# EAGLE design xio (EAGLE 5.02)
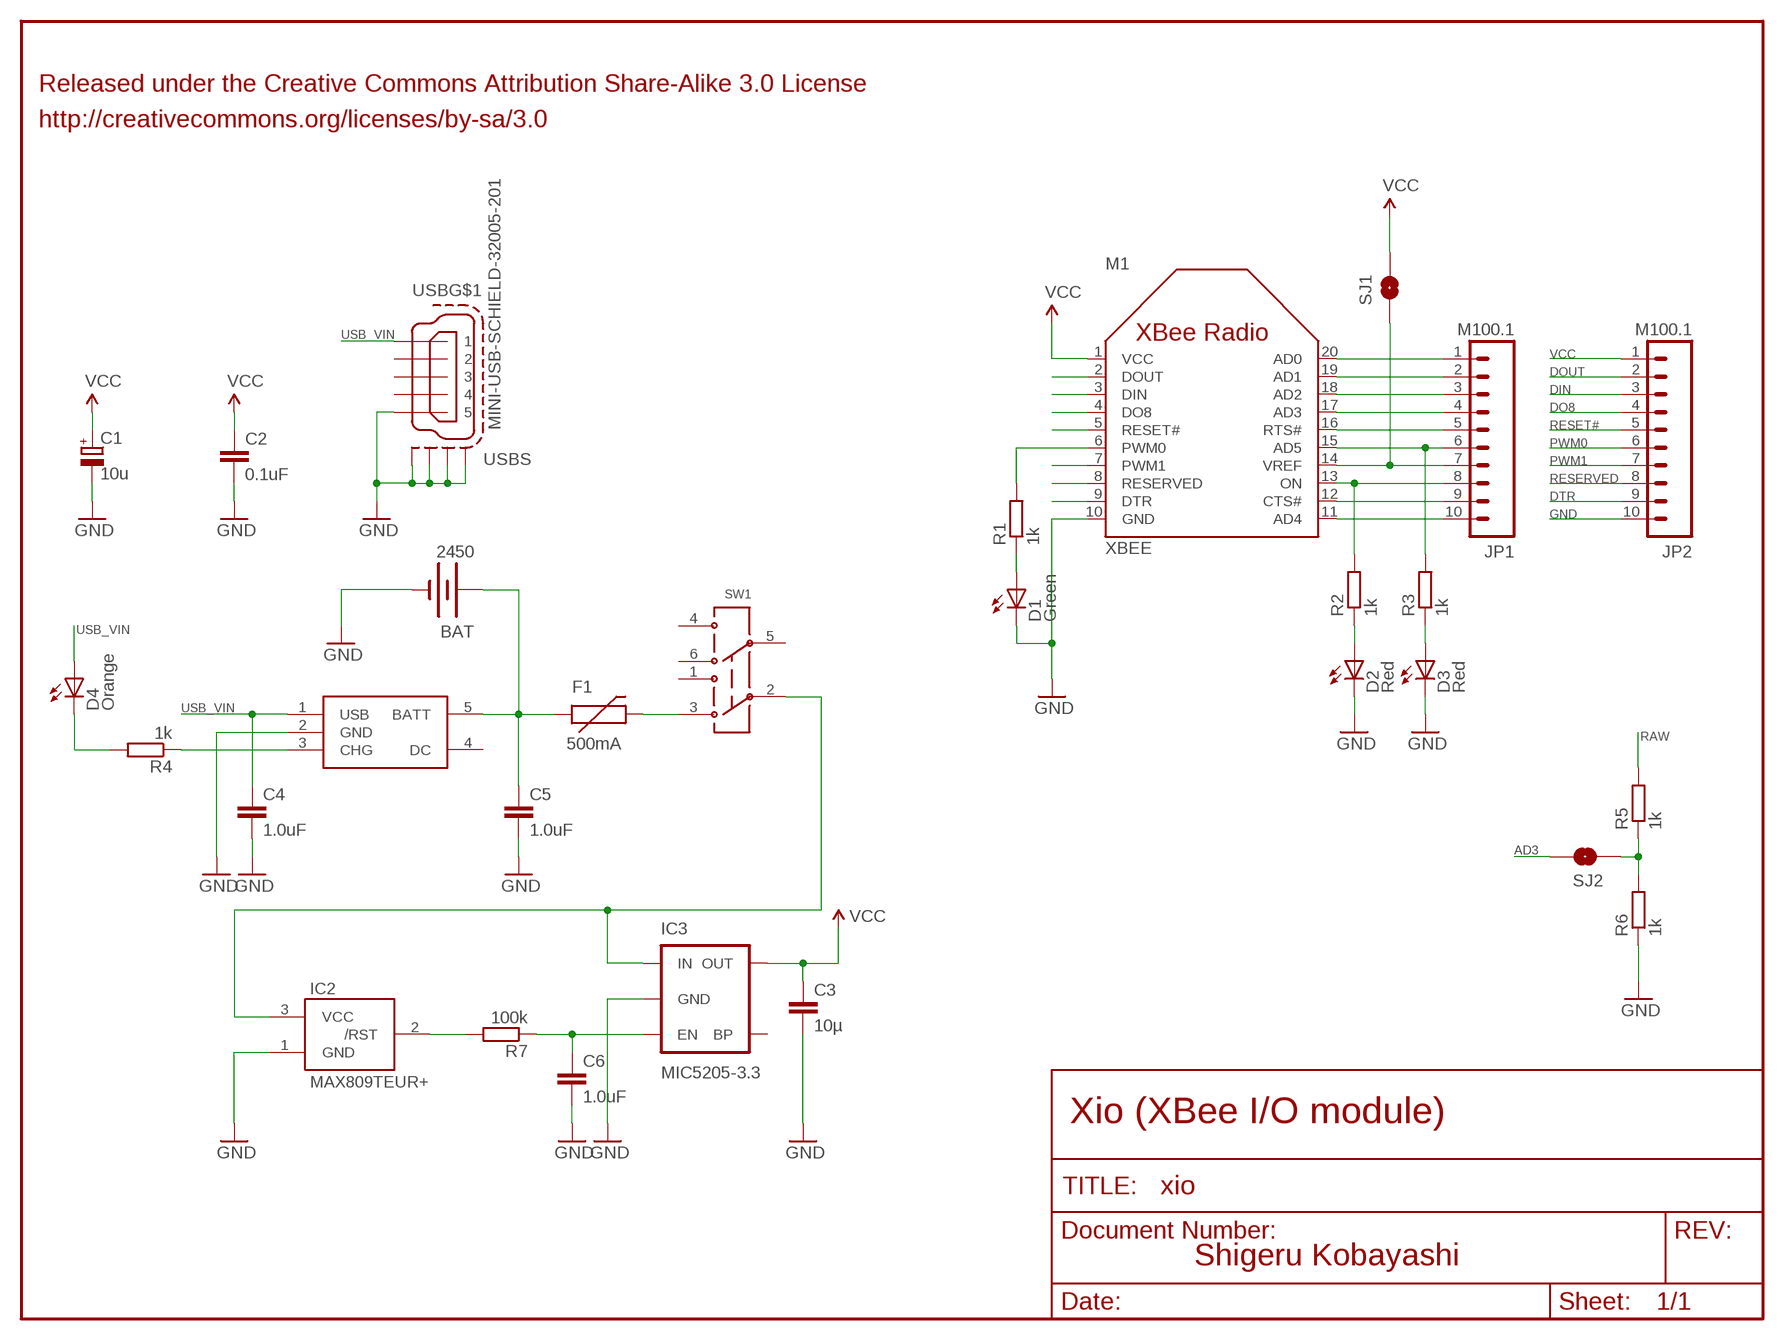
[diagram p0: schematic, sheet 1]

## Parts
BAT  2450  BATTERY  [3009]
C1  10u  CPOL-EUC  [PANASONIC_C]
C2  0.1uF  CAP0603  [0603]
C3  10µ  C-EUC0805K  [C0805K]
C4  1.0uF  CAP0603  [0603]
C5  1.0uF  CAP0603  [0603]
C6  1.0uF  CAP0603  [0603]
D1  Green  LEDCHIPLED_0805  [CHIPLED_0805]
D2  Red  LEDCHIPLED_0805  [CHIPLED_0805]
D3  Red  LEDCHIPLED_0805  [CHIPLED_0805]
D4  Orange  LEDCHIPLED_0805  [CHIPLED_0805]
F1  500mA  PTCSMD  [PTC-1206]
IC1  MAX1555  [SOT23-5]
IC2  MAX809TEUR+  MAX809TEUR  [SOT23]
IC3  MIC5205-3.3  V_REG_LDOSMD  [SOT23-5]
JP1  M100.1  [1X10]
JP2  M100.1  [1X10]
M1  XBEE  [XBEE]
R1  1k  R-EU_R0603  [R0603]
R2  1k  R-EU_R0603  [R0603]
R3  1k  R-EU_R0603  [R0603]
R4  1k  R-EU_R0603  [R0603]
R5  1k  R-EU_R0603  [R0603]
R6  1k  R-EU_R0603  [R0603]
R7  100k  R-EU_R0603  [R0603]
SJ1  SOLDERJUMPERNO  [SJ-NO]
SJ2  SOLDERJUMPERNO  [SJ-NO]
SW1  AYZ0202  [AYZ0202]
USB  MINI-USB-SCHIELD-32005-201  [32005-201]

## Nets
AD3: JP1.4 M1.17(AD3) SJ2.2
AD4: JP1.10 M1.11(AD4)
DIN: JP2.3 M1.3(DIN)
DO8: JP2.4 M1.4(DO8)
DOUT: JP2.2 M1.2(DOUT)
DTR: JP2.9 M1.9(DTR)
GND: BAT.- C1.- C2.2 C3.2 C4.2 C5.2 C6.2 D1.C D2.C D3.C IC1.2(GND) IC2.1(GND) IC3.2(GND) JP2.10 M1.10(GND) R6.1 USB.5 USB.M1(S:S1) USB.M2(S:S2) USB.M3(S:S3) USB.M4(S:S4)
N$1: JP1.8 M1.13(ON) R2.2
N$2: JP1.1 M1.20(AD0)
N$3: D1.A R1.1
N$4: IC2.2(/RST) R7.2
N$6: D2.A R2.1
N$7: JP1.2 M1.19(AD1)
N$8: D4.C R4.2
N$9: F1.2 SW1.3
N$10: JP1.3 M1.18(AD2)
N$11: IC1.3(CHG) R4.1
N$12: C6.1 IC3.3(EN) R7.1
N$13: JP1.5 M1.16(RTS#)
N$14: JP1.6 M1.15(AD5) R3.2
N$15: JP1.7 M1.14(VREF) SJ1.1
N$16: JP1.9 M1.12(CTS#)
N$18: D3.A R3.1
N$19: R5.1 R6.2 SJ2.1
PWM0: JP2.6 M1.6(PWM0) R1.2
PWM1: JP2.7 M1.7(PWM1)
RAW: IC2.3(VCC) IC3.1(IN) R5.2 SW1.2
RESERVED: JP2.8 M1.8(RESERVED)
RESET#: JP2.5 M1.5(RESET#)
USB_VIN: C4.1 D4.A IC1.1(USB) USB.1
VBATT: BAT.+@1(+) C5.1 F1.1 IC1.5(BATT)
VCC [VCC]: C1.+ C2.1 C3.1 IC3.5(OUT) JP2.1 M1.1(VCC) SJ1.2
Unconnected: IC1.4(DC) IC3.4(BP) SW1.1 SW1.4 SW1.5 SW1.6 USB.2 USB.3 USB.4

## Notes on the sheet
- Released under the Creative Commons Attribution Share-Alike 3.0 License
- http://creativecommons.org/licenses/by-sa/3.0
- Xio (XBee I/O module)
- Shigeru Kobayashi

## Library data of the parts
BAT = keystone:BATTERY: Battery Holders 2032 coin cell and 2450 coin cell.
C1 = rcl:CPOL-EU: POLARIZED CAPACITOR, European symbol
C2 C4-C6 = SparkFun:CAP: Capacitor Standard 0603 ceramic capacitor, and 0.1" leaded capacitor.
C3 = rcl:C-EU: CAPACITOR, European symbol
D1-D4 = led:LED: LED OSRAM: - CHIPLED LG R971, LG N971, LY N971, LG Q971, LY Q971, LO R971, LY R971 LH N974, LH R974 LS Q976, LO Q976, LY Q976 LO Q996 - Hyper CHIPLED LW Q18S LB Q993, LB Q99A, LB R99A - SideLED LS A670, LO A670, LY A670, LG A670, LP A670 LB A673, LV A673, LT A673, LW A673 LH A674 LY A675 LS A676, LA A676, LO A676, LY A676, LW A676 LS A679, LY A679, LG A679 - Hyper Micro SIDELED® LS Y876, LA Y876, LO Y876, LY Y876 LT Y87S - SmartLED LW L88C, LW L88S LB L89C, LB L89S, LG L890 LS L89K, LO L89K, LY L89K LS L896, LA L896, LO L896, LY L896 - TOPLED LS T670, LO T670, LY T670, LG T670, LP T670 LSG T670, LSP T670, LSY T670, LOP T670, LYG T670 LG T671, LOG T671, LSG T671 LB T673, LV T673, LT T673, LW T673 LH T674 LS T676, LA T676, LO T676, LY T676, LB T676, LH T676, LSB T676, LW T676 LB T67C, LV T67C, LT T67C, LS T67K, LO T67K, LY T67K, LW E67C LS E67B, LA E67B, LO E67B, LY E67B, LB E67C, LV E67C, LT E67C LW T67C LS T679, LY T679, LG T679 LS T770, LO T770, LY T770, LG T770, LP T770 LB T773, LV T773, LT T773, LW T773 LH T774 LS E675, LA E675, LY E675, LS T675 LS T776, LA T776, LO T776, LY T776, LB T776 LHGB T686 LT T68C, LB T68C - Hyper Mini TOPLED® LB M676 - Mini TOPLED Santana® LG M470 LS M47K, LO M47K, LY M47K Source: http://www.osram.convergy.de - LUMILED® LXK2-PW12-R00, LXK2-PW12-S00, LXK2-PW14-U00, LXK2-PW14-V00 LXK2-PM12-R00, LXK2-PM12-S00, LXK2-PM14-U00 LXK2-PE12-Q00, LXK2-PE12-R00, LXK2-PE12-S00, LXK2-PE14-T00, LXK2-PE14-U00 LXK2-PB12-K00, LXK2-PB12-L00, LXK2-PB12-M00, LXK2-PB14-N00, LXK2-PB14-P00, LXK2-PB14-Q00 LXK2-PR12-L00, LXK2-PR12-M00, LXK2-PR14-Q00, LXK2-PR14-R00 LXK2-PD12-Q00, LXK2-PD12-R00, LXK2-PD12-S00 LXK2-PH12-R00, LXK2-PH12-S00 LXK2-PL12-P00, LXK2-PL12-Q00, LXK2-PL12-R00 Source: www.luxeon.com
F1 = SparkFun:PTC: Resettable Fuse PTC Resettable Fuse. Spark Fun Electronics SKU : COM-08357
IC1 = SparkFun:MAX1555: MAX1555 Lithium Charger IC SOT-23 Lithium Polymer charging IC. Schematic element and footprint proven. Spark Fun Electronics SKU : COM-00674
IC2 = maxim-10:MAX809*: 3-Pin Microprocessor Reset Circuit
IC3 = SparkFun:V_REG_LDO: Voltage Regulator LDO Standard 150mA LDO voltage regulator in SOT-23 layout. Micrel part MIC5205. BP (by-pass) pin is used to lower output noise with 470pF cap.
JP1 JP2 = SparkFun:M10: Header 10 Standard 10-pin 0.1" header. Use with straight break away headers (SKU : PRT-00116), right angle break away headers (PRT-00553), swiss pins (PRT-00743), machine pins (PRT-00117), and female headers (PRT-00115).
M1 = digi_xbee:XBEE
R1-R7 = rcl:R-EU_: RESISTOR, European symbol
SJ1 SJ2 = SparkFun:SOLDERJUMPER: Solder Jumper Standard SMD solder jumper. Used to automate production. Two varients : Normally Open and Normally Closed are the same, but have different paste layers. NC will have a large amount of paste and should jumper during reflow.
SW1 = SparkFun:AYZ0202: SPDT Slide Switch Simple SMD single-pull double-throw slide switch. Good for less than 350mA power switch, switching UARTs between devices, etc. Spark Fun Electronics SKU : COM-00597
USB = con-cypressindustries:MINI-USB-SCHIELD-: MINI USB-B Conector Source: www.cypressindustries.com

## Net classes
0 Default: width 0.203 mm
1 VCC: width 0.381 mm
2 LEDPower: width 0.203 mm
3 ButtonSignal: width 0.203 mm

## Board
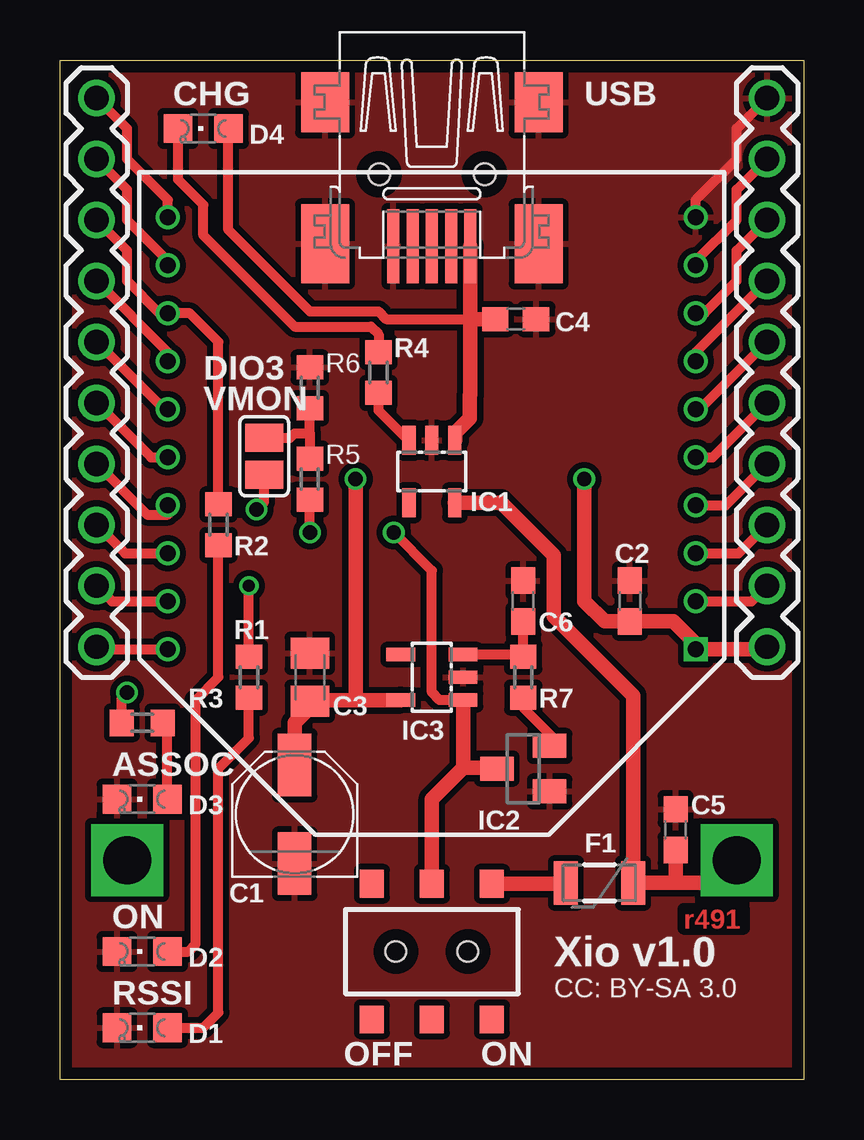
[diagram p1: board, top side]
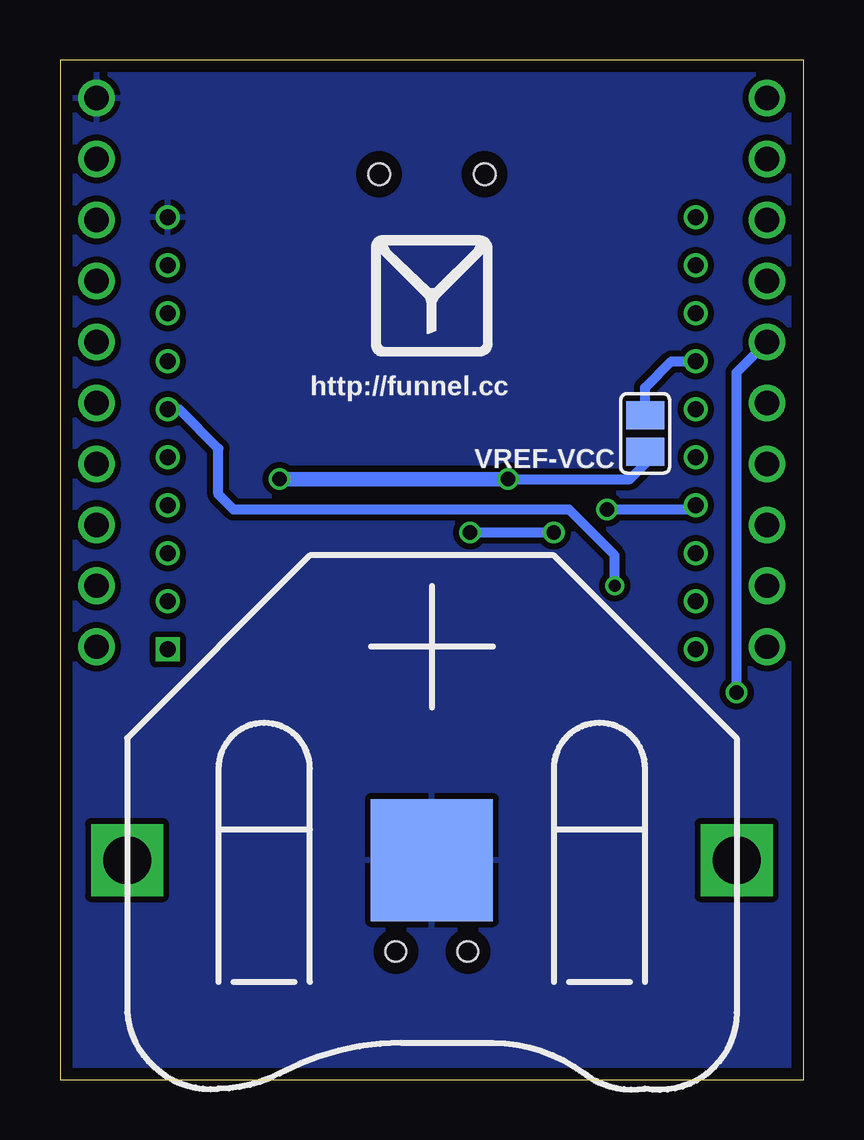
[diagram p2: board, bottom side, seen from below]

Size 30.99 x 42.48 mm. Coordinates in mm from the lower left corner, seen from the top.
Outline: 30.99,42.48 30.99,0 0,0 0,42.48 30.99,42.48
Copper layers (1*16): Top 0.035mm / dielectric 1.5mm / Bottom 0.035mm
Design rules "p_ban_2layer *": minimum track width 5mil, minimum drill 0.3mm, track to track 5mil, track to pad 5mil, pad to pad 5mil, via to via 5mil, smd to smd 5mil, copper to edge 0.5mm, drill to drill 0.3mm, minimum pad ring 0.15mm, minimum via ring 0.15mm, stop-mask expansion 4mil, vias tented up to drill 0.35mm, thermal gap 10mil

### Footprints (pad centres in the part's own frame; a part is rotated, then mirrored left to right if it is on the bottom)
3009 = drill 2 square: +@1 12.7,0; +@2 -12.7,0 | smd 5.08 x 5.08: - 0,0
PANASONIC_C = smd 2.6 x 1.4: + 2.05,0; - -2.05,0
0603 = smd 1.1 x 1: 1 -0.85,0; 2 0.85,0
C0805K = smd 1.3 x 1.6: 1 -1,0; 2 1,0
CHIPLED_0805 = smd 1.2 x 1.2: A 0,-1.05; C 0,1.05
PTC-1206 = smd 1 x 1.8: 1 -1.4,0; 2 1.4,0
SOT23-5 = smd 0.55 x 1.2: 1 -0.95,-1.3; 2 0,-1.3; 3 0.95,-1.3; 4 0.95,1.3; 5 -0.95,1.3
SOT23 = smd 1 x 1.4: 1 -0.95,-1.1; 2 0.95,-1.1; 3 0,1.1
1X10 = drill 1.016 round: 1 0,0; 2 2.54,0; 3 5.08,0; 4 7.62,0; 5 10.16,0; 6 12.7,0; 7 15.24,0; 8 17.78,0; 9 20.32,0; 10 22.86,0
XBEE = drill 0.66 square: 1 -11,9 | drill 0.66 round: 2 -11,7; 3 -11,5; 4 -11,3; 5 -11,1; 6 -11,-1; 7 -11,-3; 8 -11,-5; 9 -11,-7; 10 -11,-9; 11 11,-9; 12 11,-7; 13 11,-5; 14 11,-3; 15 11,-1; 16 11,1; 17 11,3; 18 11,5; 19 11,7; 20 11,9
R0603 = smd 1 x 1.1: 1 -0.85,0; 2 0.85,0
SJ-NO = smd 1.168 x 1.6: 1 -0.762,0; 2 0.762,0
AYZ0202 = smd 1 x 1.15: 1 -2.5,2.825; 2 0,2.825; 3 2.5,2.825; 4 -2.5,-2.825; 5 0,-2.825; 6 2.5,-2.825 | hole 0.85: 1.5,0; -1.5,0
32005-201 = smd 3.1 x 0.5: 1 3,1.6; 2 3,0.8; 3 3,0; 4 3,-0.8; 5 3,-1.6 | smd 2.5 x 2: M1 -3,-4.45; M2 -3,4.45 | smd 3.3 x 2: M3 2.9,4.45; M4 2.9,-4.45 | hole 0.9: 0,2.2; 0,-2.2

### Placement (x,y rotation side)
BAT  15.49,9.14 180 bottom
C1  9.78,11.05 90 top
C2  23.75,19.94 90 top
C3  10.41,16.76 90 top
C4  18.99,31.69 0 top
C5  25.65,10.41 90 top
C6  19.3,19.94 90 top
D1  3.43,2.16 90 top
D2  3.43,5.33 90 top
D3  3.43,11.68 90 top
D4  5.97,39.62 90 top
F1  22.48,8.19 180 top
IC1  15.49,25.34 180 top
IC2  19.3,12.95 90 top
IC3  15.49,16.76 90 top
JP1  1.52,18.03 90 top
JP2  29.46,18.03 90 top
M1  15.49,26.92 180 top
R1  7.87,16.76 90 top
R2  6.6,23.11 90 top
R3  3.43,14.86 180 top
R4  13.27,29.46 90 top
R5  10.41,25.02 270 top
R6  10.41,28.83 270 top
R7  19.3,16.76 270 top
SJ1  6.6,26.92 270 bottom
SJ2  8.51,25.97 270 top
SW1  15.49,5.33 0 top
U$1  [FUNNEL_LOGO_TOP_SMALL]  15.49,32.64 0 bottom
USB  15.49,37.72 270 top

### Tracks (layer width: path | path; a pad name or v marks a point on that pad's centre or on a via)
AD3  (via drill 0.6)
  Top 0.406: M1.17 4.49,23.54 3.63,23.54 JP1.4 | SJ2.2 8.51,24.07 v8.19,23.75
  Bottom 0.406: 4.49,23.95 4.38,24.07 | M1.17 4.49,23.95 | v8.19,23.75 4.7,23.75 4.49,23.95
AD4
  Top 0.406: M1.11 4.49,36.65 2.79,38.35 2.79,39.62 JP1.10
DIN
  Top 0.406: M1.3 28.27,21.92 JP2.3
DO8
  Top 0.406: M1.4 27.73,23.92 JP2.4
DOUT
  Top 0.406: M1.2 28.81,19.92 JP2.2
DTR
  Top 0.406: M1.9 26.49,34.11 28.19,35.81 28.19,37.08 JP2.9
GND
  Top 0.406: M1.10 26.49,36.65 28.19,38.35 28.19,39.62 JP2.10
  pour Top (isolate 0.254, rank 2): -1.02,43.43 32,43.43 32,-1.02 -1.02,-1.02
  pour Bottom (isolate 0.254): 0.25,44.7 30.73,44.7 30.73,-1.02 0.25,-1.02
N$1
  Top 0.406: R2.2 6.6,30.73 5.41,31.92 M1.13 4.14,31.92 2.79,33.27 2.79,34.54 JP1.8
N$2
  Top 0.406: M1.20 1.63,17.92 JP1.1
N$3
  Top 0.406: R1.1 7.87,14.22 6.6,12.95 6.6,2.79 5.97,2.16 D1.A
N$4
  Top 0.406: IC2.2 20.4,14.05 20.57,14.22 19.3,15.49 R7.2
N$6
  Top 0.406: D2.A 5.33,5.33 5.65,5.65 5.65,15.81 6.6,16.76 R2.1
N$7
  Top 0.406: M1.19 2.17,19.92 JP1.2
N$8
  Top 0.406: D4.C 4.92,37.5 5.97,36.45 5.97,35.18 9.78,31.37 12.95,31.37 13.27,31.05 R4.2
N$9
  Top 0.406: F1.2 21.21,8.19 21.18,8.16
  Top 0.61: SW1.3 21.18,8.16
N$10
  Top 0.406: M1.18 2.71,21.92 JP1.3
N$11
  Top 0.406: R4.1 13.27,27.88 14.51,26.64 IC1.3
N$12
  Top 0.406: IC3.3 19.3,17.71 19.3,17.72 R7.1 C6.1 19.3,19.3
N$13
  Top 0.406: M1.16 3.79,25.92 JP1.5
N$14  (via drill 0.6)
  Top 0.406: R3.2 2.58,15.91 v2.79,16.13 | M1.15 4.33,27.92 JP1.6
  Bottom 0.406: v2.79,16.13 2.79,29.46 JP1.6
N$15
  Top 0.406: M1.14 4.49,30.3 JP1.7
  Bottom 0.406: M1.14 5.51,29.92 6.6,28.83 SJ1.1
N$16
  Top 0.406: M1.12 4.49,34.11 2.79,35.81 2.79,37.08 JP1.9
N$18
  Top 0.406: R3.1 4.06,14.86 4.48,14.44 D3.A
N$19
  Top 0.406: 10.41,25.65 R5.1 10.41,26.92 | 10.41,28.19 R6.2 10.41,26.92 | 10.41,26.92 9.78,26.92 9.59,26.73 SJ2.1
PWM0  (via drill 0.5)
  Top 0.406: R1.2 v7.87,20.57 | M1.6 26.65,27.92 JP2.6
  Bottom 0.406: M1.6 26.02,27.92 24.38,26.29 24.38,24.38 23.75,23.75 9.78,23.75 7.87,21.84 v7.87,20.57
PWM1
  Top 0.406: M1.7 26.49,30.3 JP2.7
RAW  (via drill 0.6)
  Top 0.406: 10.41,24.38 R5.2 v10.41,22.8 | IC2.3 18.03,12.95 18,12.98 | IC3.1 15.81,15.81 15.49,16.13 15.49,21.21 v13.91,22.8
  Top 0.61: SW1.2 15.49,11.68 16.79,12.98 | 16.79,12.98 IC3.1 | 16.79,12.98 18,12.98
  Bottom 0.406: v13.91,22.8 v10.41,22.8
RESERVED
  Top 0.406: M1.8 26.84,31.92 28.19,33.27 28.19,34.54 JP2.8
RESET#
  Top 0.406: M1.5 27.19,25.92 JP2.5
USB_VIN
  Top 0.406: 16.48,26.64 IC1.1 | D4.A 7.02,35.4 10.41,32 13.27,32 13.59,31.69 17.09,31.69
  Top 0.61: 17.09,31.69 17.09,28.52 17.08,28.51 17.08,27.56 16.48,26.95 16.48,26.64 | 17.09,31.69 USB.1 | 17.09,31.69 C4.1
VBATT
  Top 0.61: 25.65,8.19 F1.1 23.88,16 20.57,19.3 20.57,21.84 18.38,24.04 IC1.5 | 25.65,8.19 27.24,8.19 BAT.+@1 | 25.65,8.19 C5.1
VCC  (via drill 0.6)
  Top 0.61: JP2.1 29.35,17.92 M1.1 26.61,18.03 25.55,19.09 C2.1 22.69,19.09 21.84,19.94 v21.84,25.02 | 10.41,15.49 C3.1 | 12.32,15.81 10.73,15.81 10.41,15.49 | 12.32,15.81 IC3.5 | 12.32,15.81 v12.32,25.02 | C1.+ 9.78,14.86 10.41,15.49
  Bottom 0.406: SJ1.2 6.6,25.65 7.24,25.02 v12.32,25.02
  Bottom 0.61: v12.32,25.02 v21.84,25.02

### Text on the board
Top: r491
tPlace: CHG | USB | DIO3 | VMON | ASSOC | ON | Xio v1.0 | RSSI | CC: BY-SA 3.0 | OFF | ON
bPlace: http://funnel.cc
tNames: F1
bNames: VREF-VCC